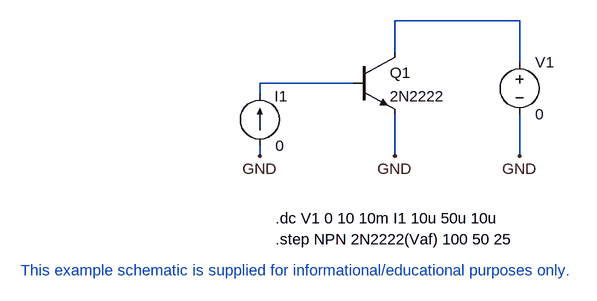
[diagram p0: schematic stepmodelparam.asc]
stepmodelparam.asc, the LTspice schematic file:
Version 4
SHEET 1 2112 1600
WIRE 1728 1408 1728 1344
WIRE 1728 1248 1728 1200
WIRE 1728 1200 1920 1200
WIRE 1920 1200 1920 1264
WIRE 1520 1408 1520 1392
WIRE 1520 1312 1520 1296
WIRE 1520 1296 1664 1296
WIRE 1920 1344 1920 1408
FLAG 1520 1408 GND
FLAG 1728 1408 GND
FLAG 1920 1408 GND
SYMBOL npn 1664 1248 R0
SYMATTR InstName Q1
SYMATTR Value 2N2222
SYMBOL current 1520 1392 M180
WINDOW 0 23 76 Left 0
WINDOW 3 24 0 Left 0
SYMATTR InstName I1
SYMATTR Value 0
SYMBOL voltage 1920 1248 R0
WINDOW 39 0 0 Left 0
WINDOW 123 0 0 Left 0
SYMATTR InstName V1
SYMATTR Value 0
text 1544 1504 Left 0 !.dc V1 0 10 10m I1 10u 50u 10u
text 1544 1536 Left 0 !.step NPN 2N2222(Vaf) 100 50 25
text 1152 1584 Left 0 ;This example schematic is supplied for informational/educational purposes only.

The netlist it stands for:
* stepmodelparam.asc
Q1 N001 N002 GND 0 2N2222
I1 GND N002 0
V1 N001 GND 0
.model NPN NPN
.model PNP PNP
.lib standard.bjt
.dc V1 0 10 10m I1 10u 50u 10u
.step NPN 2N2222(Vaf) 100 50 25
* This example schematic is supplied for informational/educational purposes only.
.backanno
.end